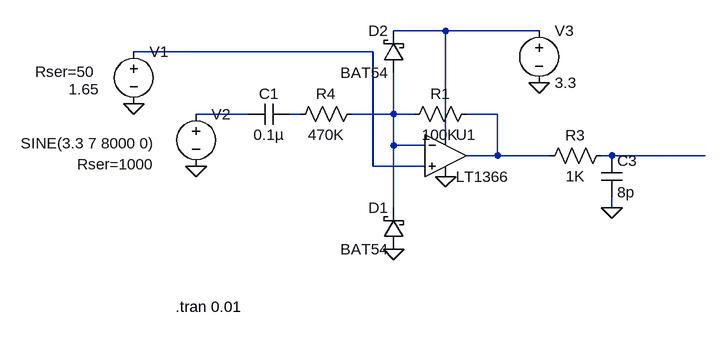
[diagram p0: schematic knock_input.asc]
knock_input.asc, the LTspice schematic file:
Version 4
SHEET 1 964 680
WIRE 448 -80 368 -80
WIRE 592 -80 448 -80
WIRE 336 -48 -32 -48
WIRE 144 48 64 48
WIRE 224 48 208 48
WIRE 368 48 368 -16
WIRE 368 48 304 48
WIRE 400 48 368 48
WIRE 528 48 480 48
WIRE 448 80 448 -80
WIRE 368 96 368 48
WIRE 416 96 368 96
WIRE 528 112 528 48
WIRE 528 112 480 112
WIRE 608 112 528 112
WIRE 704 112 688 112
WIRE 848 112 704 112
WIRE 336 128 336 -48
WIRE 416 128 336 128
WIRE 368 192 368 96
WIRE 704 192 704 176
FLAG 64 128 0
FLAG 592 0 0
FLAG 448 144 0
FLAG 704 192 0
FLAG -32 32 0
FLAG 368 256 0
SYMBOL voltage 64 32 R0
WINDOW 123 0 0 Left 2
WINDOW 39 -183 93 Left 2
WINDOW 3 -270 61 Left 2
SYMATTR SpiceLine Rser=1000
SYMATTR InstName V2
SYMATTR Value SINE(3.3 7 8000 0)
SYMBOL voltage 592 -96 R0
WINDOW 123 0 0 Left 2
WINDOW 39 0 0 Left 2
SYMATTR InstName V3
SYMATTR Value 3.3
SYMBOL cap 208 32 R90
WINDOW 0 0 32 VBottom 2
WINDOW 3 32 32 VTop 2
SYMATTR InstName C1
SYMATTR Value 0.1µ
SYMATTR SpiceLine V=16 Irms=1.816 Rser=0.031 Lser=0
SYMBOL res 320 32 R90
WINDOW 0 0 56 VBottom 2
WINDOW 3 32 56 VTop 2
SYMATTR InstName R4
SYMATTR Value 470K
SYMBOL res 592 128 R270
WINDOW 0 32 56 VTop 2
WINDOW 3 0 56 VBottom 2
SYMATTR InstName R3
SYMATTR Value 1K
SYMBOL cap 688 112 R0
SYMATTR InstName C3
SYMATTR Value 8p
SYMBOL Opamps\\LT1366 448 48 R0
SYMATTR InstName U1
SYMBOL voltage -32 -64 R0
WINDOW 123 0 0 Left 2
WINDOW 39 -152 47 Left 2
WINDOW 3 -100 74 Left 2
SYMATTR SpiceLine Rser=50
SYMATTR InstName V1
SYMATTR Value 1.65
SYMBOL res 384 64 R270
WINDOW 0 32 56 VTop 2
WINDOW 3 0 56 VBottom 2
SYMATTR InstName R1
SYMATTR Value 100K
SYMBOL schottky 384 256 R180
WINDOW 0 24 64 Left 2
WINDOW 3 24 0 Left 2
SYMATTR InstName D1
SYMATTR Value BAT54
SYMATTR Description Diode
SYMATTR Type diode
SYMBOL schottky 384 -16 R180
WINDOW 0 24 64 Left 2
WINDOW 3 24 0 Left 2
SYMATTR InstName D2
SYMATTR Value BAT54
SYMATTR Description Diode
SYMATTR Type diode
TEXT 32 344 Left 2 !.tran 0.01

The netlist it stands for:
* knock_input.asc
V2 N003 0 SINE(3.3 7 8000 0) Rser=1000
V3 N001 0 3.3
C1 N004 N003 0.1µ V=16 Irms=1.816 Rser=0.031 Lser=0
R4 N005 N004 470K
R3 N006 N007 1K
C3 N007 0 8p
XU1 N002 N005 N001 0 N006 LT1366  ; pins In+ In- V+ V- OUT
V1 N002 0 1.65 Rser=50
R1 N005 N006 100K
D1 0 N005 BAT54
D2 N005 N001 BAT54
.model D D
.lib standard.dio
.tran 0.01
.lib LTC.lib
.backanno
.end